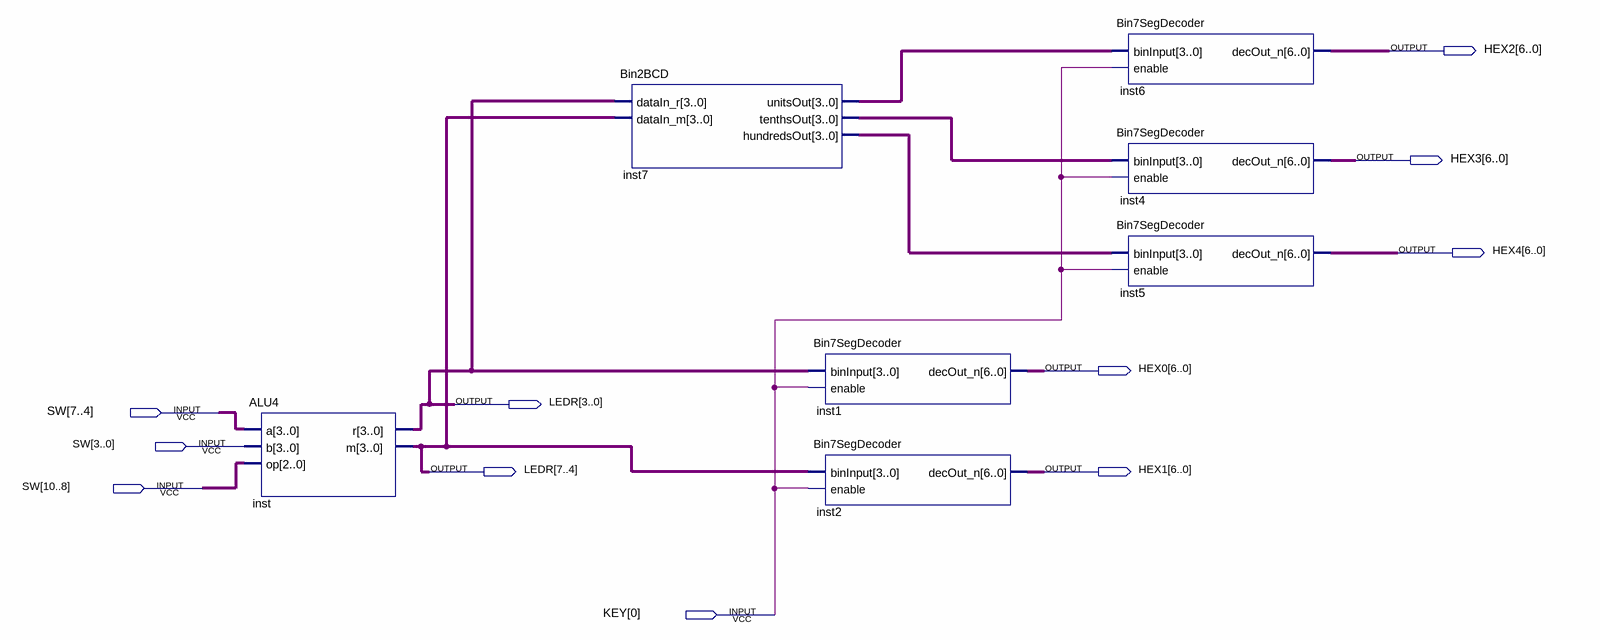
[diagram p0: schematic sheet]
// Quartus schematic ALUDemo.bdf as structural Verilog: 7 symbols, 11 pins
module ALUDemo (
  input  [10:0] SW,
  input  [0:0] KEY,
  output [6:0] HEX2,
  output [6:0] HEX3,
  output [6:0] HEX4,
  output [6:0] HEX0,
  output [7:0] LEDR,
  output [6:0] HEX1
);

  wire [3:0] inst7_hundredsout, inst7_tenthsout, inst7_unitsout;

  ALU4 inst (.a(SW[7:4]), .b(SW[3:0]), .op(SW[10:8]), .r(LEDR[3:0]), .m(LEDR[7:4]));
  Bin2BCD inst7 (
    .dataIn_r(LEDR[3:0]), .dataIn_m(LEDR[7:4]), .unitsOut(inst7_unitsout), .tenthsOut(inst7_tenthsout),
    .hundredsOut(inst7_hundredsout));
  Bin7SegDecoder inst1 (.binInput(LEDR[3:0]), .enable(KEY[0]), .decOut_n(HEX0));
  Bin7SegDecoder inst2 (.binInput(LEDR[7:4]), .enable(KEY[0]), .decOut_n(HEX1));
  Bin7SegDecoder inst6 (.binInput(inst7_unitsout), .enable(KEY[0]), .decOut_n(HEX2));
  Bin7SegDecoder inst4 (.binInput(inst7_tenthsout), .enable(KEY[0]), .decOut_n(HEX3));
  Bin7SegDecoder inst5 (.binInput(inst7_hundredsout), .enable(KEY[0]), .decOut_n(HEX4));
endmodule
